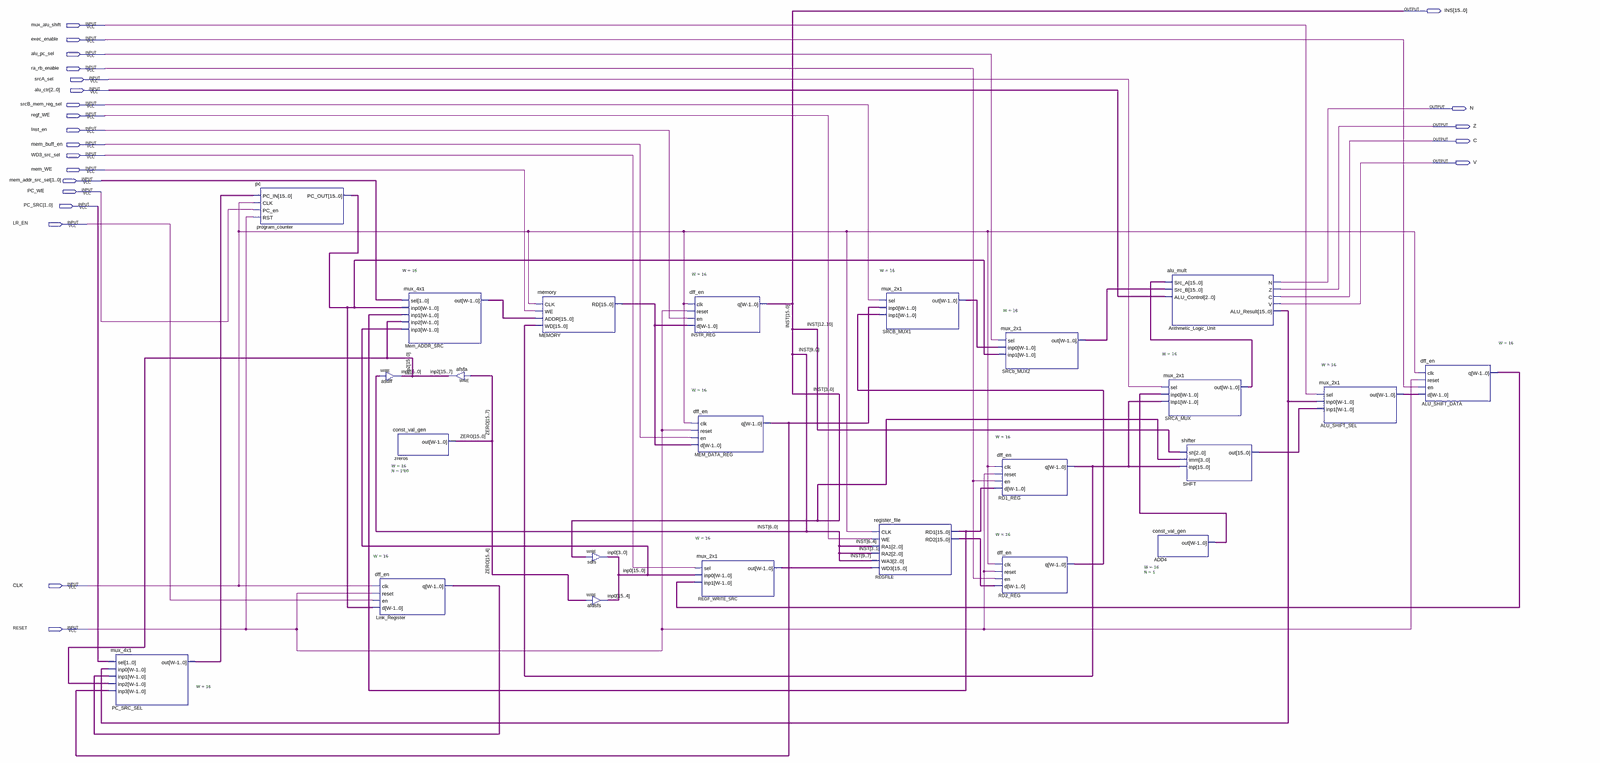
[diagram p0: schematic sheet, whole]
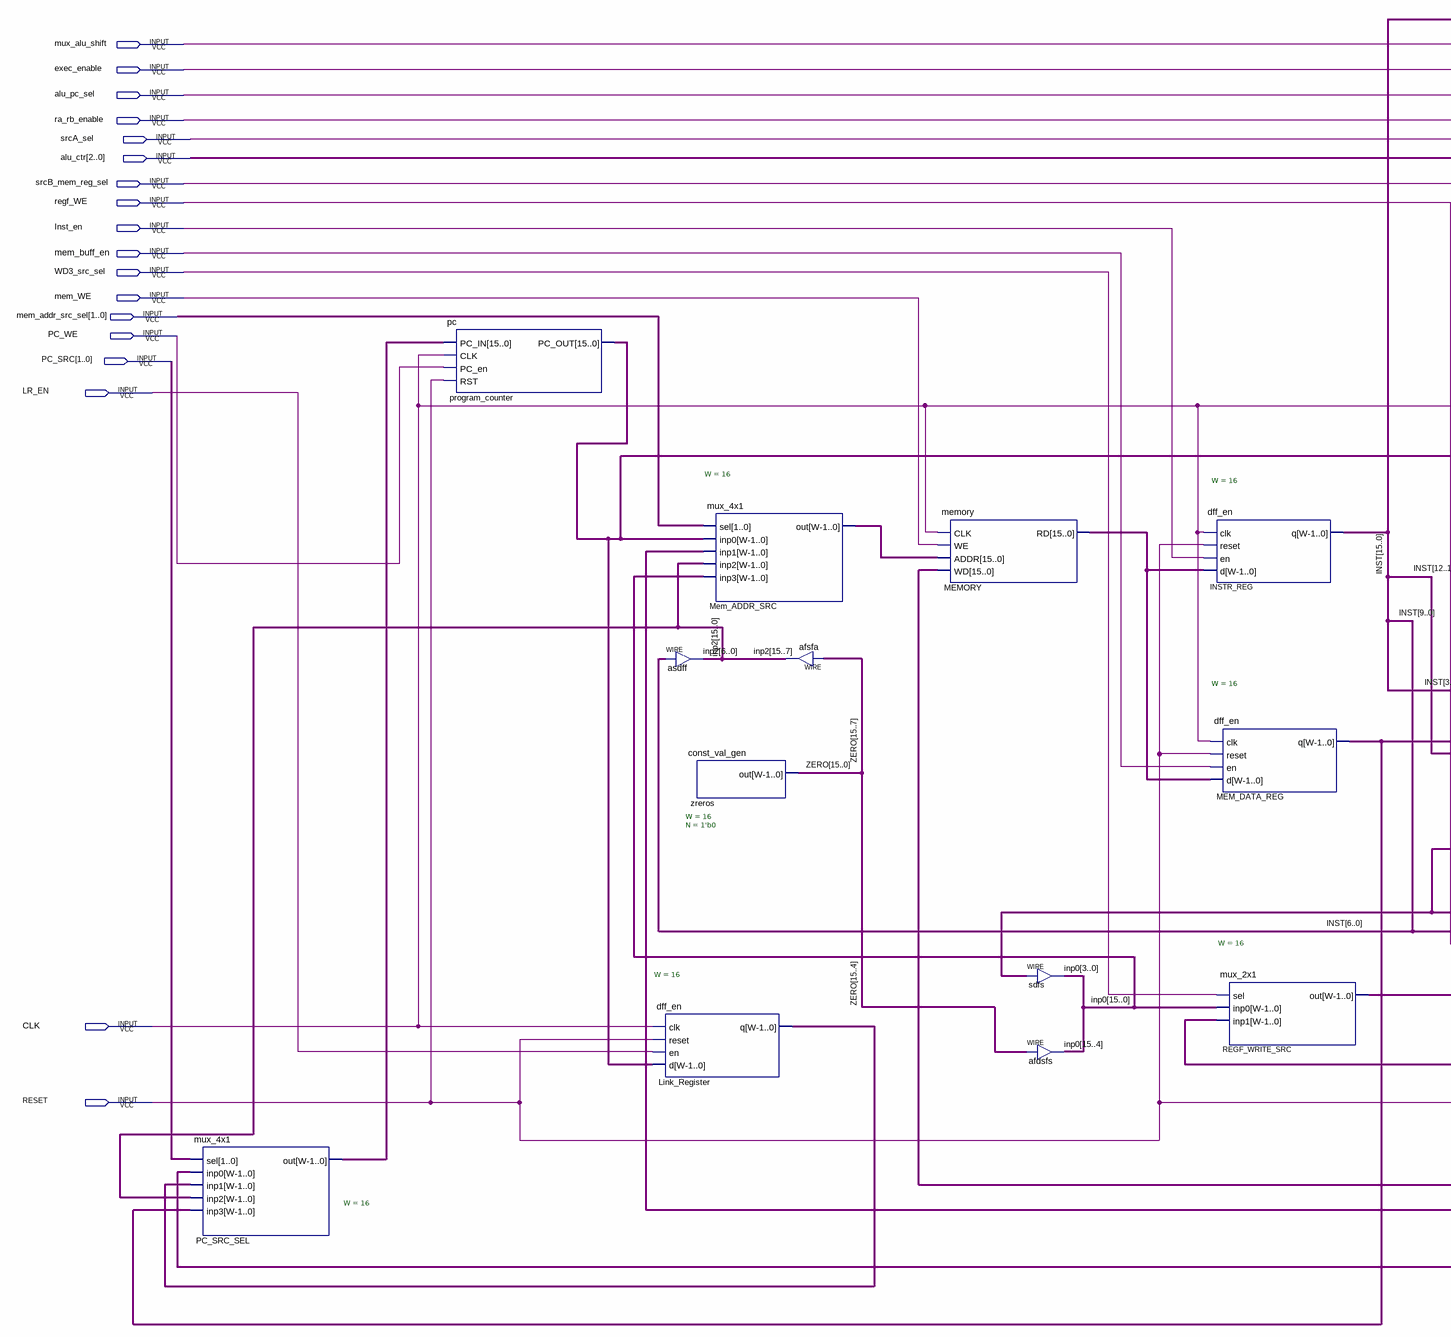
[diagram p1: schematic sheet, left part]
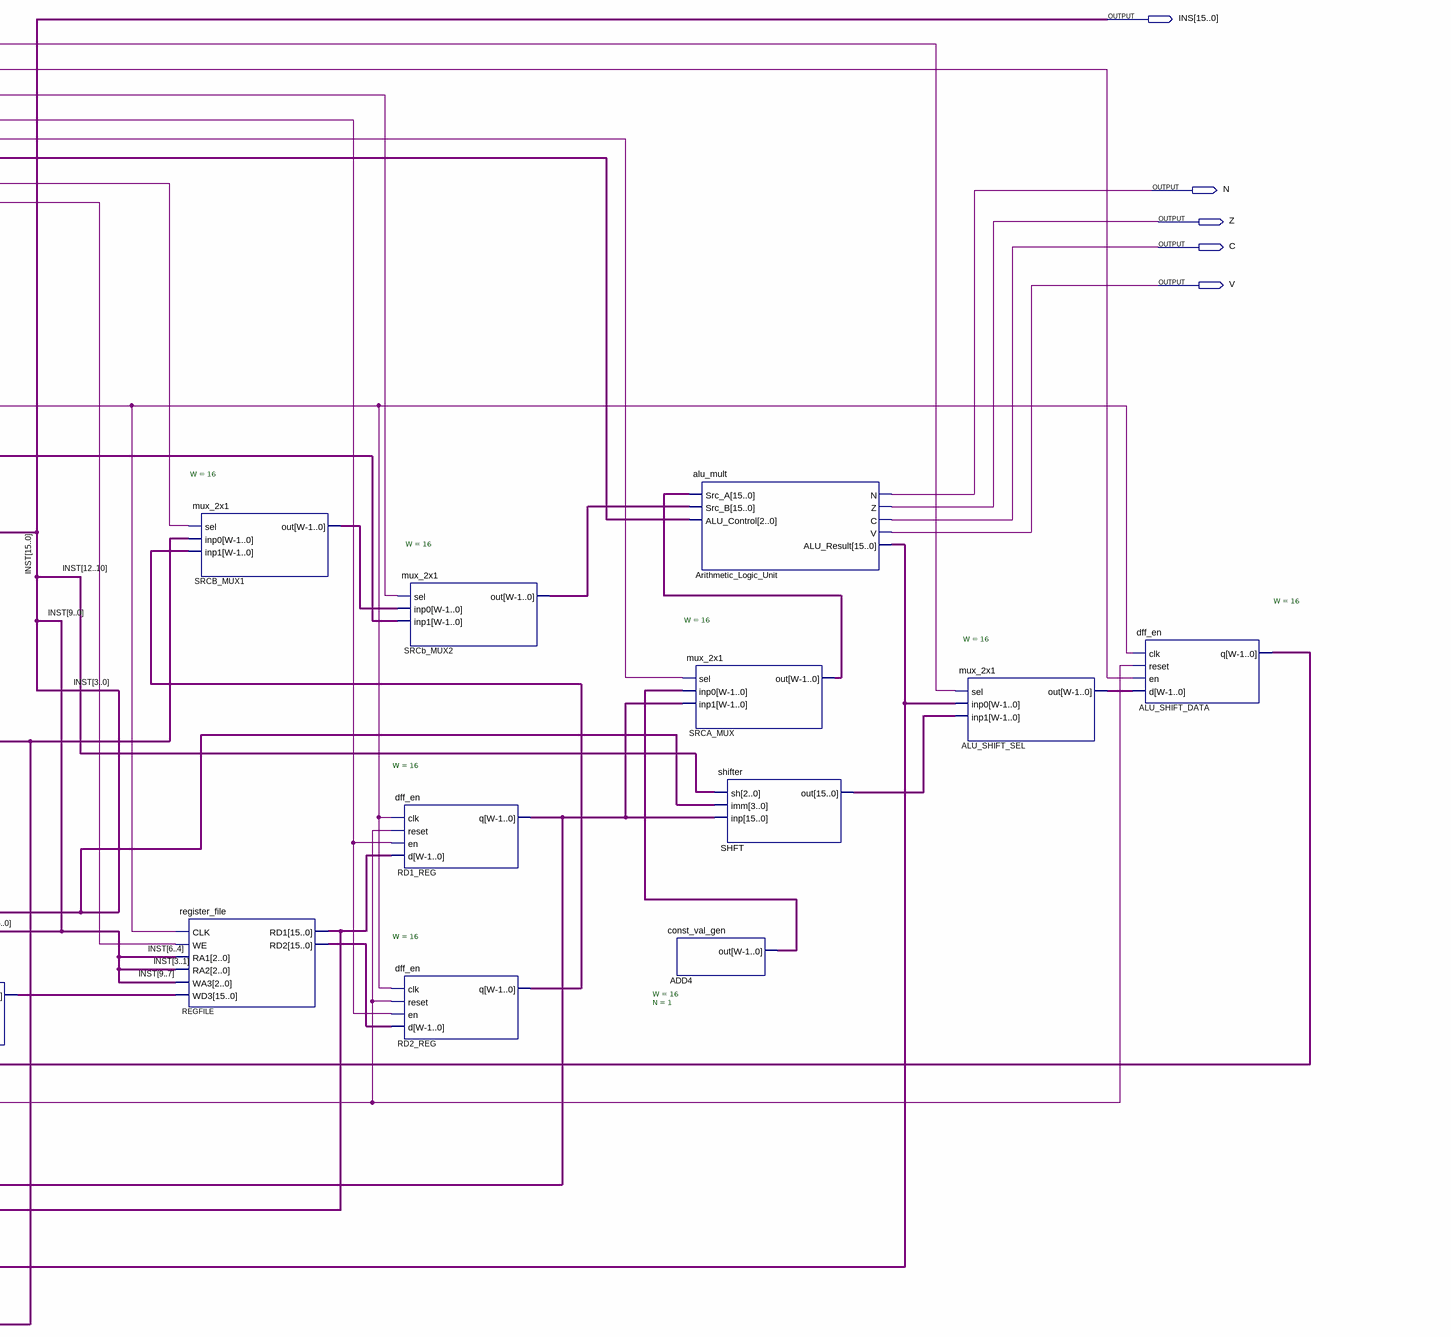
[diagram p2: schematic sheet, right part]
// Quartus schematic datapath.bdf as structural Verilog: 24 symbols, 23 pins
module datapath (
  input  mux_alu_shift,
  input  exec_enable,
  input  alu_pc_sel,
  input  ra_rb_enable,
  input  srcA_sel,
  input  [2:0] alu_ctr,
  input  srcB_mem_reg_sel,
  input  regf_WE,
  input  Inst_en,
  input  mem_buff_en,
  input  WD3_src_sel,
  input  mem_WE,
  input  [1:0] mem_addr_src_sel,
  input  PC_WE,
  input  [1:0] PC_SRC,
  input  LR_EN,
  input  CLK,
  input  RESET,
  output [15:0] INS,
  output N,
  output Z,
  output C,
  output V
);

  wire [15:0] ADD4_out, ALU_SHIFT_DATA_q, ALU_SHIFT_SEL_out, Arithmetic_Logic_Unit_alu_result, inp0, inp2,
       Link_Register_q, Mem_ADDR_SRC_out, MEM_DATA_REG_q, MEMORY_rd, PC_SRC_SEL_out, program_counter_pc_out,
       RD1_REG_q, RD2_REG_q, REGF_WRITE_SRC_out, REGFILE_rd1, REGFILE_rd2, SHFT_out, SRCA_MUX_out,
       SRCB_MUX1_out, SRCb_MUX2_out, ZERO;

  mux_4x1 #(.W(16)) PC_SRC_SEL (
    .sel(PC_SRC), .inp0(Arithmetic_Logic_Unit_alu_result), .inp1(Link_Register_q), .inp2(inp2),
    .inp3(MEM_DATA_REG_q), .out(PC_SRC_SEL_out));
  pc program_counter (.PC_IN(PC_SRC_SEL_out), .CLK(CLK), .PC_en(PC_WE), .RST(RESET), .PC_OUT(program_counter_pc_out));
  assign inp2[6:0] = INS[6:0];  // WIRE asdff
  dff_en #(.W(16)) Link_Register (
    .clk(CLK), .reset(RESET), .en(LR_EN), .d(program_counter_pc_out), .q(Link_Register_q));
  mux_4x1 #(.W(16)) Mem_ADDR_SRC (
    .sel(mem_addr_src_sel), .inp0(program_counter_pc_out), .inp1(REGFILE_rd1), .inp2(inp2), .inp3(inp0),
    .out(Mem_ADDR_SRC_out));
  const_val_gen #(.W(16), .N(1'b0)) zreros (.out(ZERO));
  assign inp2[15:7] = ZERO[15:7];  // WIRE afsfa
  memory MEMORY (.CLK(CLK), .WE(mem_WE), .ADDR(Mem_ADDR_SRC_out), .WD(RD1_REG_q), .RD(MEMORY_rd));
  assign inp0[3:0] = INS[3:0];  // WIRE sdfs
  assign inp0[15:4] = ZERO[15:4];  // WIRE afdsfs
  dff_en #(.W(16)) INSTR_REG (.clk(CLK), .reset(RESET), .en(Inst_en), .d(MEMORY_rd), .q(INS));
  dff_en #(.W(16)) MEM_DATA_REG (.clk(CLK), .reset(RESET), .en(mem_buff_en), .d(MEMORY_rd), .q(MEM_DATA_REG_q));
  mux_2x1 #(.W(16)) REGF_WRITE_SRC (.sel(WD3_src_sel), .inp0(inp0), .inp1(ALU_SHIFT_DATA_q), .out(REGF_WRITE_SRC_out));
  register_file REGFILE (
    .CLK(CLK), .WE(regf_WE), .RA1(INS[6:4]), .RA2(INS[3:1]), .WA3(INS[9:7]), .WD3(REGF_WRITE_SRC_out),
    .RD1(REGFILE_rd1), .RD2(REGFILE_rd2));
  mux_2x1 #(.W(16)) SRCB_MUX1 (.sel(srcB_mem_reg_sel), .inp0(MEM_DATA_REG_q), .inp1(RD2_REG_q), .out(SRCB_MUX1_out));
  mux_2x1 #(.W(16)) SRCb_MUX2 (
    .sel(alu_pc_sel), .inp0(SRCB_MUX1_out), .inp1(program_counter_pc_out), .out(SRCb_MUX2_out));
  dff_en #(.W(16)) RD1_REG (.clk(CLK), .reset(RESET), .en(ra_rb_enable), .d(REGFILE_rd1), .q(RD1_REG_q));
  dff_en #(.W(16)) RD2_REG (.clk(CLK), .reset(RESET), .en(ra_rb_enable), .d(REGFILE_rd2), .q(RD2_REG_q));
  mux_2x1 #(.W(16)) SRCA_MUX (.sel(srcA_sel), .inp0(ADD4_out), .inp1(RD1_REG_q), .out(SRCA_MUX_out));
  const_val_gen #(.W(16), .N(1)) ADD4 (.out(ADD4_out));
  alu_mult Arithmetic_Logic_Unit (
    .Src_A(SRCA_MUX_out), .Src_B(SRCb_MUX2_out), .ALU_Control(alu_ctr), .N(N), .Z(Z), .C(C), .V(V),
    .ALU_Result(Arithmetic_Logic_Unit_alu_result));
  shifter SHFT (.sh(INS[12:10]), .imm(INS[3:0]), .inp(RD1_REG_q), .out(SHFT_out));
  mux_2x1 #(.W(16)) ALU_SHIFT_SEL (
    .sel(mux_alu_shift), .inp0(Arithmetic_Logic_Unit_alu_result), .inp1(SHFT_out), .out(ALU_SHIFT_SEL_out));
  dff_en #(.W(16)) ALU_SHIFT_DATA (
    .clk(CLK), .reset(RESET), .en(exec_enable), .d(ALU_SHIFT_SEL_out), .q(ALU_SHIFT_DATA_q));

  // Other names for the same wires on the sheet: INST[15:0] = INS
endmodule
